# EAGLE schematic Output Logic (EAGLE 6.4)
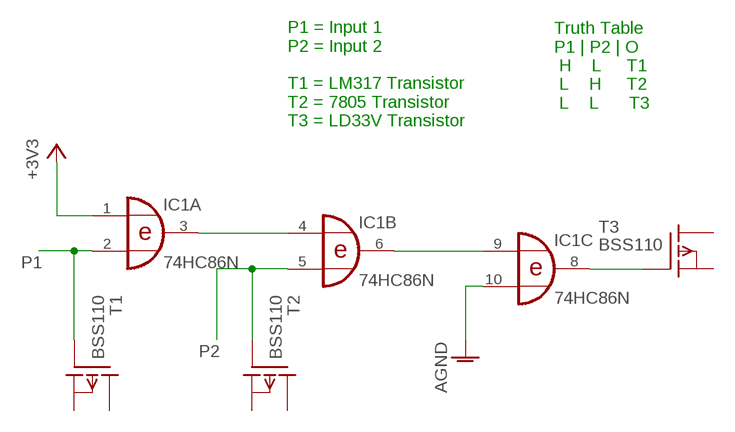
[diagram p0: schematic, sheet 1]

## Parts
IC1  74HC86N  [DIL14]
T1  BSS110  [TO92]
T2  BSS110  [TO92]
T3  BSS110  [TO92]

## Nets
+3V3: IC1.1(A:I0)
AGND: IC1.10(C:I1)
N$1: IC1.3(A:O) IC1.4(B:I0)
N$2: IC1.6(B:O) IC1.9(C:I0)
N$5: IC1.8(C:O) T3.2(G)
P1: IC1.2(A:I1) T1.2(G)
P2: IC1.5(B:I1) T2.2(G)
Unconnected: IC1.11(D:O) IC1.12(D:I0) IC1.13(D:I1) T1.1(S) T1.3(D) T2.1(S) T2.3(D) T3.1(S) T3.3(D)

## Notes on the sheet
- Truth Table
  P1 | P2 | O
   H    L     T1
   L    H     T2
   L    L      T3
- P1 = Input 1
  P2 = Input 2
  
  T1 = LM317 Transistor
  T2 = 7805 Transistor
  T3 = LD33V Transistor

## Power pins joined to a net without a drawn wire
GND: IC1.7(P:GND)
VCC: IC1.14(P:VCC)

## Library data of the parts
IC1 = 74xx-eu:74*86: Quad 2-input EXCLUSIVE-OR (XOR) gate
T1-T3 = transistor-fet:BSS110: P-Channel Enhancement MOSFET -50V; -0,17A; 6Ohm